# Altium project BI_820_Trek_OBD_main_hv2.PrjPcb
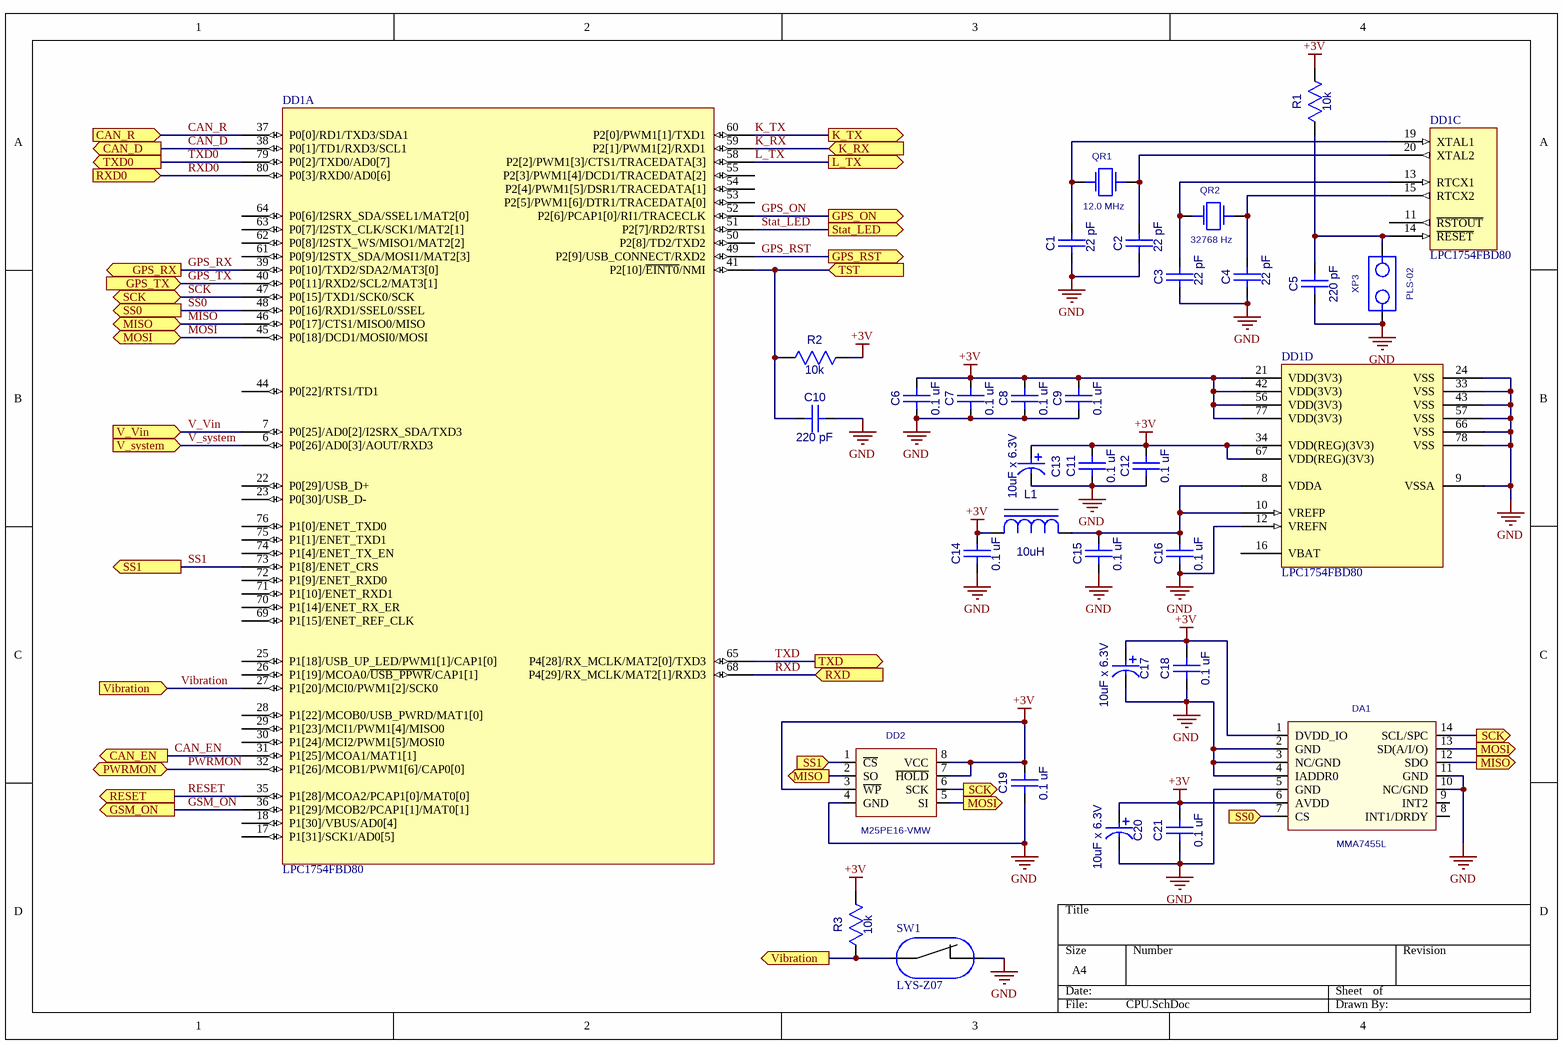
[diagram p0: CPU.SchDoc]
3 sheets, 109 parts. Net scope: flat (ports and power ports of the same name join across sheets).
Board file: BI_820_Trek_OBD_main_hv2.PcbDoc
Sheets:
  CPU.SchDoc
  IO.SchDoc
  Power.SchDoc

## Sheet CPU.SchDoc
size A4; PageSetup: Record=PageOptions|CenterHorizontal=True|CenterVertical=True|PrintScale=0.95|XCorrection=1.00|YCorrection=1.00|PrintKind=1|BorderSize=5000000|LeftOffset=0|BottomOffset=0|Orientation=2|PaperLength=1000|PaperWidth=1000|Scale=100|PaperSource=7|PrintQuality=-4|MediaType=1|DitherType=10|PaperKind=A4, 210x297 mm|PrintScaleMode=1

### Parts
C1  22 pF  [CC0603-3M]
C2  22 pF  [CC0603-3M]
C3  22 pF  [CC0603-3M]
C4  22 pF  [CC0603-3M]
C5  220 pF  [CC0603-3M]
C6  0.1 uF  [CC0603-3M]
C7  0.1 uF  [CC0603-3M]
C8  0.1 uF  [CC0603-3M]
C9  0.1 uF  [CC0603-3M]
C10  220 pF  [CC0603-3M]
C11  0.1 uF  [CC0603-3M]
C12  0.1 uF  [CC0603-3M]
C13  10uF x 6.3V  [TAJ-A_M]
C14  0.1 uF  [CC0603-3M]
C15  0.1 uF  [CC0603-3M]
C16  0.1 uF  [CC0603-3M]
C17  10uF x 6.3V  [TAJ-A_M]
C18  0.1 uF  [CC0603-3M]
C19  0.1 uF  [CC0603-3M]
C20  10uF x 6.3V  [TAJ-A_M]
C21  0.1 uF  [CC0603-3M]
DA1  MMA7455L  [LGA-14]
DD1  LPC1754FBD80  [TQFP-80_0.5]  (parts A,C,D of 4)
DD2  M25PE16-VMW  [EIAJ_SO8]
L1  10uH  [L0603]
QR1  12.0 MHz  [AC5032_2]
QR2  32768 Hz  [QR_32768]
R1  10k  [RC0603-3M]
R2  10k  [RC0603-3M]
R3  10k  [RC0603-3M]
SW1  LYS-Z07  [LYS-Z07]
XP3  PLS-02  [PIN2W]

### Ports
CAN_D (out), CAN_EN (out), CAN_R (in), GPS_ON (out), GPS_RST (out), GPS_RX (out), GPS_TX (in), GSM_ON (out), K_RX (in), K_TX (out), L_TX (out), MISO, MOSI, PWRMON, RESET (out), RXD0 (in), RXD (in), SCK, SS0 (in), SS0 (out), SS1 (in), SS1 (out), Stat_LED (out), TST (in), TXD0 (out), TXD (out), V_system (in), V_Vin (in), Vibration (in), Vibration (out)

### Nets
+3V: C6.2(B) C7.2(B) C8.2(B) C9.2(B) C11.2(B) C12.2(B) C13.1(A) C14.2(B) C17.1(A) C18.2(B) C19.2(B) C20.1(A) C21.2(B) DA1.1(DVDD_IO) DA1.6(AVDD) DD1.21(VDD(3V3)) DD1.34(VDD(REG)(3V3)) DD1.42(VDD(3V3)) DD1.56(VDD(3V3)) DD1.67(VDD(REG)(3V3)) DD1.77(VDD(3V3)) DD2.3(~{WP}) DD2.7(~{HOLD}) DD2.8(VCC) L1.1(A) R1.2(B) R2.2(B) R3.2(B)
GND: C1.1(A) C2.1(A) C3.1(A) C4.1(A) C5.1(A) C6.1(A) C7.1(A) C8.1(A) C9.1(A) C10.2(B) C11.1(A) C12.1(A) C13.2(B) C14.1(A) C15.1(A) C16.1(A) C17.2(B) C18.1(A) C19.1(A) C20.2(B) C21.1(A) DA1.2(GND) DA1.3(NC/GND) DA1.4(IADDR0) DA1.5(GND) DA1.10(NC/GND) DA1.11(GND) DD1.9(VSSA) DD1.12(VREFN) DD1.24(VSS) DD1.33(VSS) DD1.43(VSS) DD1.57(VSS) DD1.66(VSS) DD1.78(VSS) DD2.4(GND) SW1.2 XP3.1
CAN_D: DD1.38(P0[1]/TD1/RXD3/SCL1) ; port CAN_D
CAN_EN: DD1.31(P1[25]/MCOA1/MAT1[1]) ; port CAN_EN
CAN_R: DD1.37(P0[0]/RD1/TXD3/SDA1) ; port CAN_R
GPS_ON: DD1.52(P2[6]/PCAP1[0]/RI1/TRACECLK) ; port GPS_ON
GPS_RST: DD1.49(P2[9]/USB_CONNECT/RXD2) ; port GPS_RST
GPS_RX: DD1.39(P0[10]/TXD2/SDA2/MAT3[0]) ; port GPS_RX
GPS_TX: DD1.40(P0[11]/RXD2/SCL2/MAT3[1]) ; port GPS_TX
GSM_ON: DD1.36(P1[29]/MCOB2/PCAP1[1]/MAT0[1]) ; port GSM_ON
K_RX: DD1.59(P2[1]/PWM1[2]/RXD1) ; port K_RX
K_TX: DD1.60(P2[0]/PWM1[1]/TXD1) ; port K_TX
L_TX: DD1.58(P2[2]/PWM1[3]/CTS1/TRACEDATA[3]) ; port L_TX
MISO: DA1.12(SDO) DD1.46(P0[17]/CTS1/MISO0/MISO) DD2.2(SO) ; port MISO
MOSI: DA1.13(SD(A/I/O)) DD1.45(P0[18]/DCD1/MOSI0/MOSI) DD2.5(SI) ; port MOSI
PWRMON: DD1.32(P1[26]/MCOB1/PWM1[6]/CAP0[0]) ; port PWRMON
RESET: DD1.35(P1[28]/MCOA2/PCAP1[0]/MAT0[0]) ; port RESET
RXD: DD1.68(P4[29]/RX_MCLK/MAT2[1]/RXD3) ; port RXD
RXD0: DD1.80(P0[3]/RXD0/AD0[6]) ; port RXD0
SCK: DA1.14(SCL/SPC) DD1.47(P0[15]/TXD1/SCK0/SCK) DD2.6(SCK) ; port SCK
SS0: DA1.7(CS) DD1.48(P0[16]/RXD1/SSEL0/SSEL) ; port SS0
SS1: DD1.73(P1[8]/ENET_CRS) DD2.1(~{CS}) ; port SS1
Stat_LED: DD1.51(P2[7]/RD2/RTS1) ; port Stat_LED
TXD: DD1.65(P4[28]/RX_MCLK/MAT2[0]/TXD3) ; port TXD
TXD0: DD1.79(P0[2]/TXD0/AD0[7]) ; port TXD0
V_system: DD1.6(P0[26]/AD0[3]/AOUT/RXD3) ; port V_system
V_Vin: DD1.7(P0[25]/AD0[2]/I2SRX_SDA/TXD3) ; port V_Vin
Vibration: DD1.27(P1[20]/MCI0/PWM1[2]/SCK0) R3.1(A) SW1.1 ; port Vibration
NetC1_2: C1.2(B) DD1.19(XTAL1) QR1.1
NetC2_2: C2.2(B) DD1.20(XTAL2) QR1.2
NetC3_2: C3.2(B) DD1.13(RTCX1) QR2.1(X1)
NetC4_2: C4.2(B) DD1.15(RTCX2) QR2.2(X2)
NetC5_2: C5.2(B) DD1.14(~{RESET}) R1.1(A) XP3.2
NetC10_1: C10.1(A) DD1.41(P2[10]/~{EINT0}/NMI) R2.1(A) ; port TST
NetC15_2: C15.2(B) C16.2(B) DD1.8(VDDA) DD1.10(VREFP) L1.2(C)

Not connected (* = marked no-connect by the designer): DA1 8(INT1/DRDY) 9(INT2); DD1 11(~{RSTOUT}) 16(VBAT) 17(P1[31]/SCK1/AD0[5]) 18(P1[30]/VBUS/AD0[4]) 22(P0[29]/USB_D+) 23(P0[30]/USB_D-) 25(P1[18]/USB_UP_LED/PWM1[1]/CAP1[0]) 26(P1[19]/MCOA0/~{USB_PPWR}/CAP1[1]) 28(P1[22]/MCOB0/USB_PWRD/MAT1[0]) 29(P1[23]/MCI1/PWM1[4]/MISO0) 30(P1[24]/MCI2/PWM1[5]/MOSI0) 44(P0[22]/RTS1/TD1) 50(P2[8]/TD2/TXD2) 53(P2[5]/PWM1[6]/DTR1/TRACEDATA[0]) 54(P2[4]/PWM1[5]/DSR1/TRACEDATA[1]) 55(P2[3]/PWM1[4]/DCD1/TRACEDATA[2]) 61(P0[9]/I2STX_SDA/MOSI1/MAT2[3]) 62(P0[8]/I2STX_WS/MISO1/MAT2[2]) 63(P0[7]/I2STX_CLK/SCK1/MAT2[1]) 64(P0[6]/I2SRX_SDA/SSEL1/MAT2[0]) 69(P1[15]/ENET_REF_CLK) 70(P1[14]/ENET_RX_ER) 71(P1[10]/ENET_RXD1) 72(P1[9]/ENET_RXD0) 74(P1[4]/ENET_TX_EN) 75(P1[1]/ENET_TXD1) 76(P1[0]/ENET_TXD0)

### Library data of the parts
C1-C12 C14-C16 C18 C19 C21 = CC0603
  C1-C4: Value: 22 pF
  C5 C10: Value: 220 pF
  C6-C9 C11 C12 C14-C16 C18 C19 C21: Value: 0.1 uF
C13 C17 C20 = TAJ-A: Value: 10uF x 6.3V
DD1 = LPC1754FBD80: Cortex -M3 32-Bit Microcontroller, 128KB Flash, 64KB RAM, 800-Lead LQFP; ComponentLink1Description: Manufacturer Link; ComponentLink1URL: http://www.nxp.com/
DD2 = S25FL016A0LMFI01: Value: M25PE16-VMW
L1 = L0603: Value: 10uH
QR1 = AC5032_2: AC5032/2; Value: 12.0 MHz
QR2 = CRYSTAL_32768: CRYSTAL_32768 Hz; Value: 32768 Hz
R1-R3 = RC0603: Value: 10k
SW1 = LYS-Z07: NC vibration sensor
XP3 = PLD-02: Value: *
DA1 = MMA7455L: Value: *

## Sheet IO.SchDoc
size A4
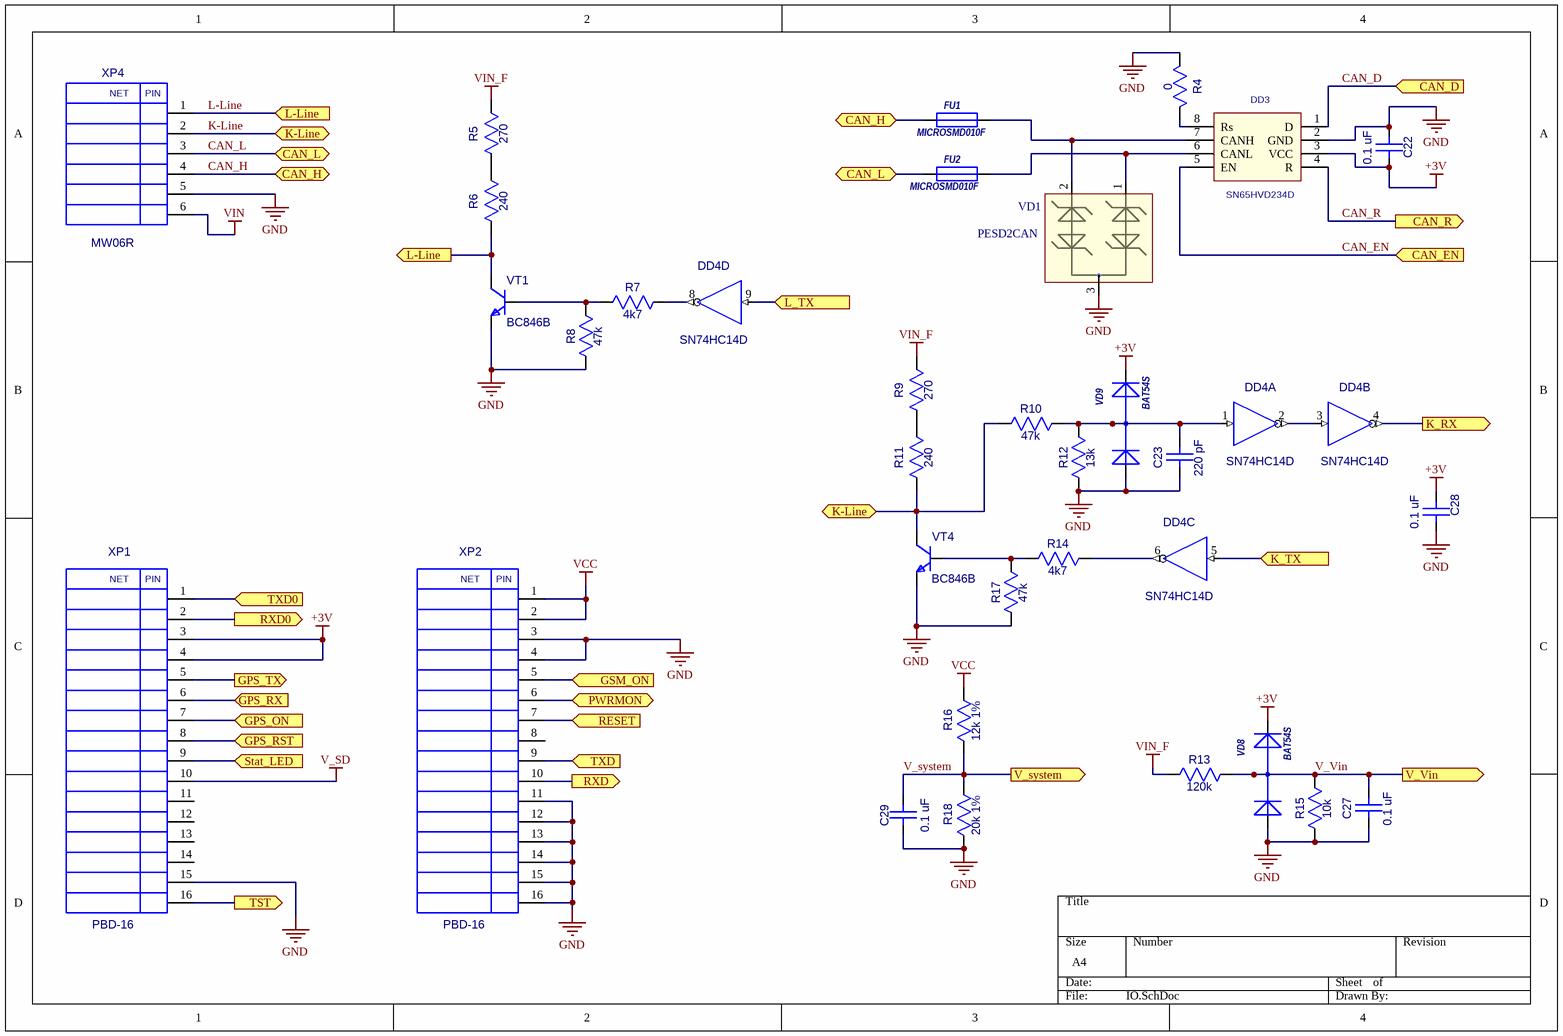
[diagram p1: IO.SchDoc]

### Parts
C22  0.1 uF  [CC0603-3M]
C23  220 pF  [CC0603-3M]
C27  0.1 uF  [CC0603-3M]
C28  0.1 uF  [CC0603-3M]
C29  0.1 uF  [CC0603-3M]
DD3  SN65HVD234D  [SO-8]
DD4  SN74HC14D  [SO14]  (parts A,B,C,D of 6)
FU1  MICROSMD010F  [RC1210]
FU2  MICROSMD010F  [RC1210]
R4  0  [RC0603-3M]
R5  270  [RC1206-2M]
R6  240  [RC1206-2M]
R7  4k7  [RC0603-3M]
R8  47k  [RC0603-3M]
R9  270  [RC1206-2M]
R10  47k  [RC0603-3M]
R11  240  [RC1206-2M]
R12  13k  [RC0603-3M]
R13  120k  [RC0603-3M]
R14  4k7  [RC0603-3M]
R15  10k  [RC0603-3M]
R16  12k 1%  [RC0603-3M]
R17  47k  [RC0603-3M]
R18  20k 1%  [RC0603-3M]
VD1  PESD2CAN  [SOT-23(123)]
VD8  BAT54S  [SOT-23(GSD)]
VD9  BAT54S  [SOT-23(GSD)]
VT1  BC846B  [SOT-23(123)]
VT4  BC846B  [SOT-23(123)]
XP1  PBD-16  [PBD16]
XP2  PBD-16  [PBD16]
XP4  MW06R  [MW06R]

### Ports
CAN_D (in), CAN_EN (in), CAN_H (bidir), CAN_L (bidir), CAN_R (out), GPS_ON (in), GPS_RST (in), GPS_RX (in), GPS_TX (out), GSM_ON (in), K-Line (bidir), K_RX (out), K_TX (in), L-Line (in), L-Line (out), L_TX (in), PWRMON, RESET (in), RXD0 (out), RXD (out), Stat_LED (in), TST (out), TXD0 (in), TXD (in), V_system (out), V_Vin (out)

### Nets
+3V: C22.1(A) C28.2(B) DD3.3(VCC) DD4.14(+5V) VD8.2(K) VD9.2(K) XP1.3 XP1.4
GND: C22.2(B) C23.2(B) C27.2(B) C28.1(A) C29.2(B) DD3.2(GND) DD4.7(GND) R4.2(B) R8.2(B) R12.2(B) R15.2(B) R17.2(B) R18.1(A) VD1.3 VD8.1(A) VD9.1(A) VT1.2(E) VT4.2(E) XP1.15 XP2.3 XP2.4 XP2.11 XP2.12 XP2.13 XP2.14 XP2.15 XP2.16 XP4.5
V_SD: XP1.10
VCC: R16.2(B) XP2.1 XP2.2
VIN: XP4.6
VIN_F: R5.2(B) R9.2(B) R13.2(B)
CAN_D: DD3.1(D) ; port CAN_D
CAN_EN: DD3.5(EN) ; port CAN_EN
CAN_H: FU1.1 XP4.4 ; port CAN_H
CAN_L: FU2.1 XP4.3 ; port CAN_L
CAN_R: DD3.4(R) ; port CAN_R
GPS_ON: XP1.7 ; port GPS_ON
GPS_RST: XP1.8 ; port GPS_RST
GPS_RX: XP1.6 ; port GPS_RX
GPS_TX: XP1.5 ; port GPS_TX
GSM_ON: XP2.5 ; port GSM_ON
K-Line: R10.2(B) R11.1(A) VT4.3(C) XP4.2 ; port K-Line
K_RX: DD4.4(Y) ; port K_RX
K_TX: DD4.5(A) ; port K_TX
L-Line: R6.1(A) VT1.3(C) XP4.1 ; port L-Line
L_TX: DD4.9(A) ; port L_TX
PWRMON: XP2.6 ; port PWRMON
RESET: XP2.7 ; port RESET
RXD: XP2.10 ; port RXD
RXD0: XP1.2 ; port RXD0
Stat_LED: XP1.9 ; port Stat_LED
TXD: XP2.9 ; port TXD
TXD0: XP1.1 ; port TXD0
V_system: C29.1(A) R16.1(A) R18.2(B) ; port V_system
V_Vin: C27.1(A) R13.1(A) R15.1(A) VD8.3(AK) ; port V_Vin
NetC10_1: XP1.16 ; port TST
NetC23_1: C23.1(A) DD4.1(A) R10.1(A) R12.1(A) VD9.3(AK)
NetDD3_6: DD3.6(CANL) FU2.2 VD1.1
NetDD3_7: DD3.7(CANH) FU1.2 VD1.2
NetDD3_8: DD3.8(Rs) R4.1(A)
NetDD4_2: DD4.2(Y) DD4.3(A)
NetDD4_6: DD4.6(Y) R14.1(A)
NetDD4_8: DD4.8(Y) R7.1(A)
NetR5_1: R5.1(A) R6.2(B)
NetR7_2: R7.2(B) R8.1(A) VT1.1(B)
NetR9_1: R9.1(A) R11.2(B)
NetR14_2: R14.2(B) R17.1(A) VT4.1(B)

Not connected (* = marked no-connect by the designer): XP1 11 12 13 14; XP2 8

### Notes on the sheet
- (in symbol MW06R) NET; PIN
- (in symbol PBD-16) NET; PIN

### Library data of the parts
C22 C23 C27-C29 = CC0603
  C22 C27-C29: Value: 0.1 uF
  C23: Value: 220 pF
DD3 = SN65HVD234D: CAN Transceiver; Value: *
DD4 = SN74HC14D: Hex Schmitt-Trigger INVERTERS; Value: *
FU1 FU2 = MICROSMD: Value: MICROSMD010F
R4 R7 R8 R10 R12-R18 = RC0603
  R4: Value: 0
  R7 R14: Value: 4k7
  R8 R10 R17: Value: 47k
  R12: Value: 13k
  R13: Value: 120k
  R15: Value: 10k
  R16: Value: 12k 1%
  R18: Value: 20k 1%
R5 R6 R9 R11 = RC1206
  R5 R9: Value: 270
  R6 R11: Value: 240
VD1 = PESD2CAN: TVS for CAN
VD8 VD9 = BAT54S: 1.0 Ampere General Purpose Rectifier; ComponentField6: Published 8-Jun-2000, Modified 11-July-2000: SIM Model Added.; Value: *
VT1 VT4 = BC846BLT1: Value: {Value}; ComponentField7: Published 29-Sep-2000; OriginalName: BC846BLT1
XP1 XP2 = PBD-16: Value: *
XP4 = MW06R: Value: *

## Sheet Power.SchDoc
size A4
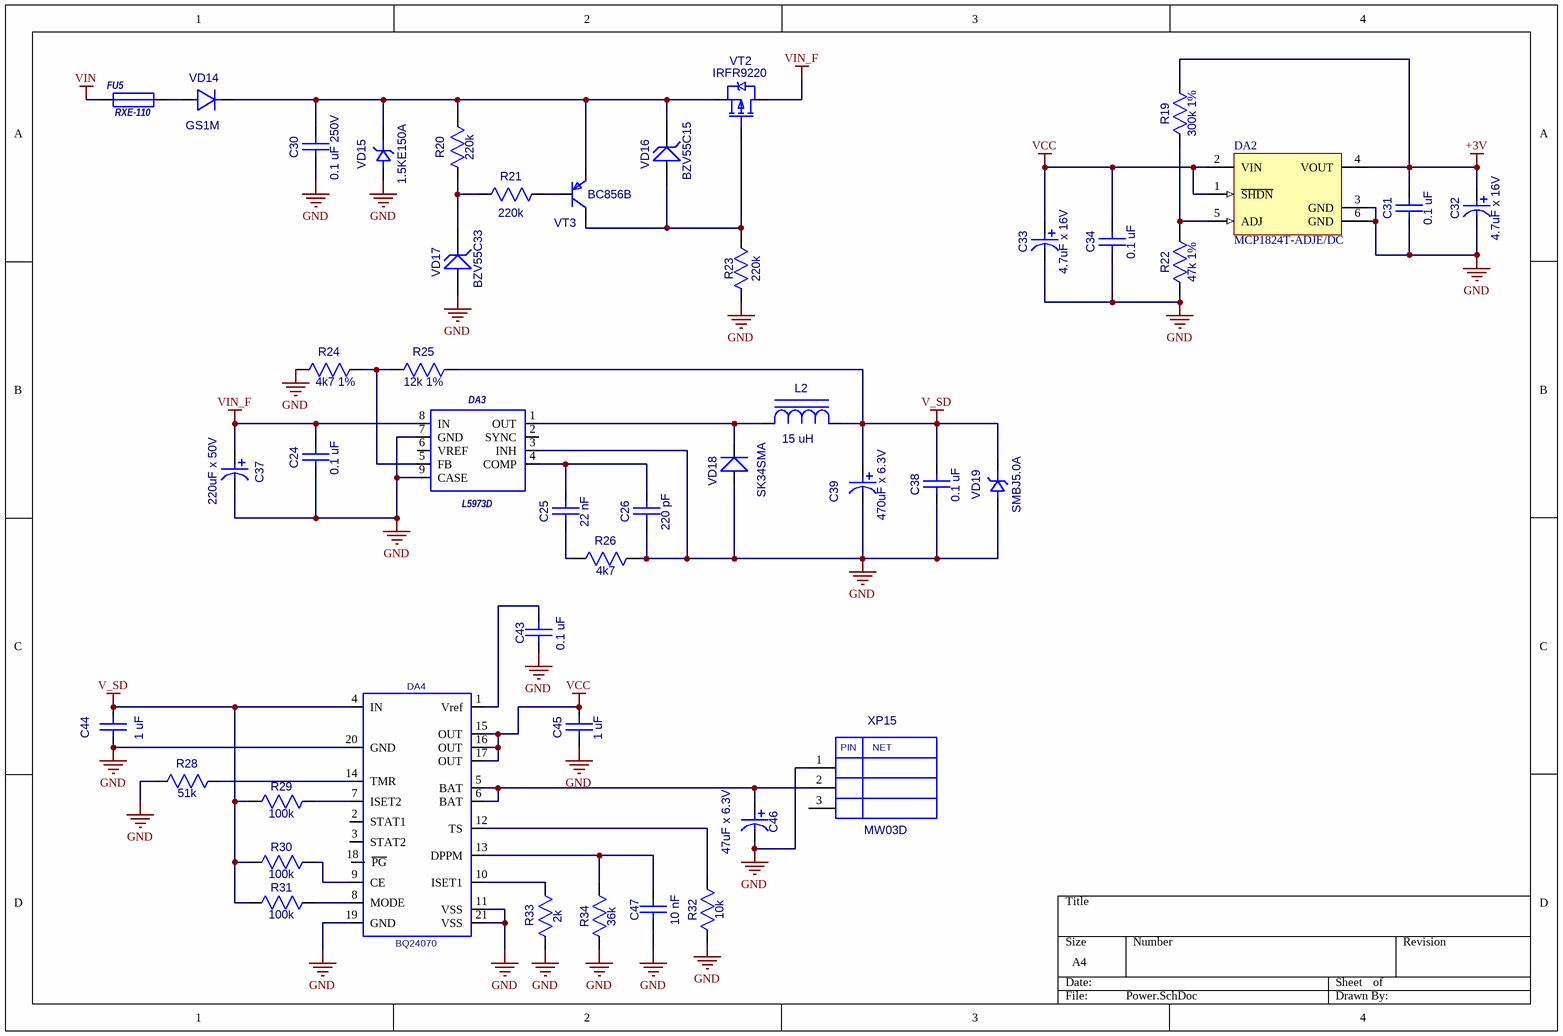
[diagram p2: Power.SchDoc]

### Parts
C24  0.1 uF  [CC0603-3M]
C25  22 nF  [CC0603-3M]
C26  220 pF  [CC0603-3M]
C30  0.1 uF 250V  [CC1206-MIDI]
C31  0.1 uF  [CC0603-3M]
C32  4.7uF x 16V  [TAJ-A_M]
C33  4.7uF x 16V  [TAJ-A_M]
C34  0.1 uF  [CC0603-3M]
C37  220uF x 50V  [CC16X10_CAP0.5(1)(Primary)]
C38  0.1 uF  [CC0603-3M]
C39  470uF x 6.3V  [TAJ-D-1M]
C43  0.1 uF  [CC0603-3M]
C44  1 uF  [CC0603-3M]
C45  1 uF  [CC0603-3M]
C46  47uF x 6.3V  [TAJ-B-1M]
C47  10 nF  [CC0603-3M]
DA2  MCP1824T-ADJE/DC  [SOT223-6]
DA3  L5973D  [SO-8_EXP_PAD]
DA4  BQ24070  [P-PQFP-N20]
FU5  RXE-110  [RXE-110]
L2  15 uH  [SDR0805]
R19  300k 1%  [RC0603-3M]
R20  220k  [RC1206-2M]
R21  220k  [RC1206-2M]
R22  47k 1%  [RC0603-3M]
R23  220k  [RC1206-2M]
R24  4k7 1%  [RC0603-3M]
R25  12k 1%  [RC0603-3M]
R26  4k7  [RC0603-3M]
R28  51k  [RC0603-3M]
R29  100k  [RC0603-3M]
R30  100k  [RC0603-3M]
R31  100k  [RC0603-3M]
R32  10k  [RC0603-3M]
R33  2k  [RC0603-3M]
R34  36k  [RC0603-3M]
VD14  GS1M  [SMA]
VD15  1.5KE150A  [DO-201]
VD16  BZV55C15  [SOD-80]
VD17  BZV55C33  [SOD-80]
VD18  SK34SMA  [SMA]
VD19  SMBJ5.0A  [SMB]
VT2  IRFR9220  [D-PAK(TO-252AA)]
VT3  BC856B  [SOT-23(123)]
XP15  MW03D  [MW03D]

### Nets
+3V: C31.2(B) C32.1(A) DA2.4(VOUT) R19.2(B)
GND: C24.2(B) C26.2(B) C30.2(B) C31.1(A) C32.2(B) C33.2(B) C34.1(A) C37.1 C38.2(B) C39.2(B) C43.2(B) C44.2(B) C45.2(B) C46.2(B) C47.2(B) DA2.3(GND) DA2.6(GND) DA3.3(INH) DA3.7(GND) DA3.9(CASE) DA4.11(VSS) DA4.19(GND) DA4.20(GND) DA4.21(VSS) R22.1(A) R23.2(B) R24.1(A) R26.2(B) R28.1(A) R32.1(A) R33.1(A) R34.1(A) VD15.1(A) VD17.1(A) VD18.1(A) VD19.1(A) XP15.1
V_SD: C38.1(A) C39.1(A) C44.1(A) DA4.4(IN) L2.2(A) R25.2(B) R29.1(A) R30.1(A) R31.1(A) VD19.2(K)
VCC: C33.1(A) C34.2(B) C45.1(A) DA2.1(~{SHDN}) DA2.2(VIN) DA4.15(OUT) DA4.16(OUT) DA4.17(OUT)
VIN: FU5.1
VIN_F: C24.1(A) C37.2 DA3.8(IN) VT2.3(D)
NetC25_1: C25.1(A) C26.1(A) DA3.4(COMP)
NetC25_2: C25.2(B) R26.1(A)
NetC30_1: C30.1(A) R20.2(B) VD14.2(K) VD15.2(K) VD16.2 VT2.2(S) VT3.2(E)
NetC43_1: C43.1(A) DA4.1(Vref)
NetC46_1: C46.1(A) DA4.5(BAT) DA4.6(BAT) XP15.2
NetC47_1: C47.1(A) DA4.13(DPPM) R34.2(B)
NetDA2_5: DA2.5(ADJ) R19.1(A) R22.2(B)
NetDA3_1: DA3.1(OUT) L2.1(C) VD18.2(K)
NetDA3_5: DA3.5(FB) R24.2(B) R25.1(A)
NetDA4_7: DA4.7(ISET2) R29.2(B)
NetDA4_8: DA4.8(MODE) R31.2(B)
NetDA4_9: DA4.9(CE) R30.2(B)
NetDA4_10: DA4.10(ISET1) R33.2(B)
NetDA4_12: DA4.12(TS) R32.2(B)
NetDA4_14: DA4.14(TMR) R28.2(B)
NetFU5_2: FU5.2 VD14.1(A)
NetR20_1: R20.1(A) R21.1(A) VD17.2
NetR21_2: R21.2(B) VT3.1(B)
NetR23_1: R23.1(A) VD16.1(A) VT2.1(G) VT3.3(C)

Not connected (* = marked no-connect by the designer): DA3 2(SYNC) 6(VREF); DA4 2(STAT1) 3(STAT2) 18(~{PG}); XP15 3

### Notes on the sheet
- (in symbol MW03D) PIN; NET

### Library data of the parts
C24-C26 C31 C34 C38 C43-C45 C47 = CC0603
  C24 C31 C34 C38 C43: Value: 0.1 uF
  C25: Value: 22 nF
  C26: Value: 220 pF
  C44 C45: Value: 1 uF
  C47: Value: 10 nF
C30 = CC1206: Value: 0.1 uF 250V
C32 C33 = TAJ-A: Value: 4.7uF x 16V
C37 = CAP0.5(1): Value: 220uF x 50V
C39 = TAJ-D: Value: 470uF x 6.3V
C46 = TAJ-B: Value: 47uF x 6.3V
DA2 = MCP1824T-ADJE/DC: 300 mA, Low Voltage, Low Quiescent Current LDO Regulator, 5-Pin SOT-223, Extended Temperature, Tape and Reel; Published: 29-Jan-2009; DatasheetVersion: revA, Aug-2007; PackageVersion: revAW, Oct-2008; PackageReference: SOT-223-DC5; Publisher: Altium Limited; PackageDescription: 5-Lead Plastic Small Outline Transistor (DC) [SOT-223]; ComponentLink1Description: Manufacturer Link; ComponentLink1URL: http://www.microchip.com; ComponentLink2Description: Datasheet; ComponentLink2URL: http://ww1.microchip.com/downloads/en/DeviceDoc/22070a.pdf; ComponentLink3Description: Packaging Specification; ComponentLink3URL: http://ww1.microchip.com/downloads/en/PackagingSpec/00049AW.pdf
L2 = SDR0805: Value: 15 uH
R19 R22 R24-R26 R28-R34 = RC0603
  R19: Value: 300k 1%
  R22: Value: 47k 1%
  R24: Value: 4k7 1%
  R25: Value: 12k 1%
  R26: Value: 4k7
  R28: Value: 51k
  R29-R31: Value: 100k
  R32: Value: 10k
  R33: Value: 2k
  R34: Value: 36k
R20 R21 R23 = RC1206: Value: 220k
VD14 = GS1M: Value: {Value}
VD15 = 1.5KE: Value: 1.5KE150A
VD16 VD17 = BZV55C12: Zener Voltage Regulator Diode; OriginalName: BZX84C10LT1; ComponentField6: Pin 2 is not connected and not drawn.; ComponentField7: Published 29-Sep-2000
  VD16: Value: BZV55C15
  VD17: Value: BZV55C33
VD18 = SK34SMA: Schottky Rectifier; Value: {Value}
VD19 = SMBJ: Value: *
VT2 = IRFR9220: HEXFET Power MOSFET; OriginalName: IRLML5103; ComponentField7: Published 8-Jun-2000; Value: IRFR9220
VT3 = BC857B: OriginalName: BC846BLT1; ComponentField7: Published 29-Sep-2000; Value: BC856B
DA4 = BQ24070: Value: *
FU5 = RXE-110: Value: *
XP15 = MW03D: Value: *

## Nets that join several sheets
+3V: CPU (28 pins), IO (8 pins), Power (C31.2 C32.1 DA2.4 R19.2)
GND: CPU (38 pins), IO (28 pins), Power (37 pins)
V_SD: IO (XP1.10), Power (10 pins)
VCC: IO (R16.2 XP2.1 XP2.2), Power (8 pins)
VIN: IO (XP4.6), Power (FU5.1)
VIN_F: IO (R5.2 R9.2 R13.2), Power (C24.1 C37.2 DA3.8 VT2.3)
CAN_D: CPU (DD1.38), IO (DD3.1)
CAN_EN: CPU (DD1.31), IO (DD3.5)
CAN_R: CPU (DD1.37), IO (DD3.4)
GPS_ON: CPU (DD1.52), IO (XP1.7)
GPS_RST: CPU (DD1.49), IO (XP1.8)
GPS_RX: CPU (DD1.39), IO (XP1.6)
GPS_TX: CPU (DD1.40), IO (XP1.5)
GSM_ON: CPU (DD1.36), IO (XP2.5)
K_RX: CPU (DD1.59), IO (DD4.4)
K_TX: CPU (DD1.60), IO (DD4.5)
L_TX: CPU (DD1.58), IO (DD4.9)
NetC10_1: CPU (C10.1 DD1.41 R2.1), IO (XP1.16)
PWRMON: CPU (DD1.32), IO (XP2.6)
RESET: CPU (DD1.35), IO (XP2.7)
RXD: CPU (DD1.68), IO (XP2.10)
RXD0: CPU (DD1.80), IO (XP1.2)
Stat_LED: CPU (DD1.51), IO (XP1.9)
TXD: CPU (DD1.65), IO (XP2.9)
TXD0: CPU (DD1.79), IO (XP1.1)
V_system: CPU (DD1.6), IO (C29.1 R16.1 R18.2)
V_Vin: CPU (DD1.7), IO (C27.1 R13.1 R15.1 VD8.3)